# Altium schematic sheet SRAM & Expansion Port.SchDoc
size A
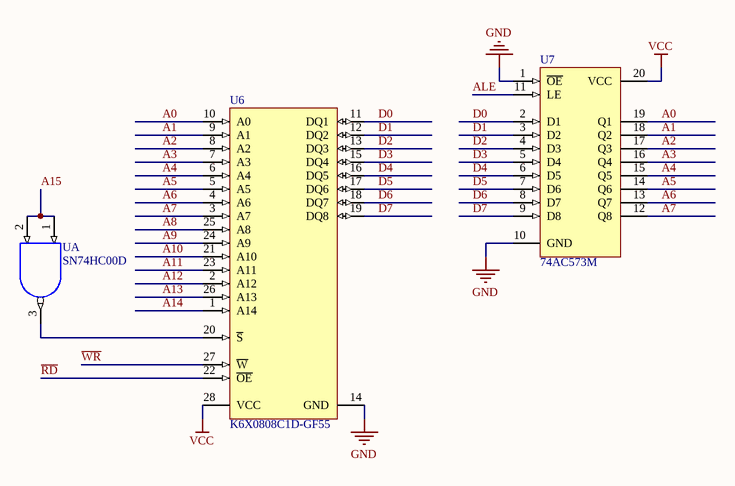
[diagram p0: SRAM & Expansion Port.SchDoc]

## Parts
U  SN74HC00D  [D014_N]  (part A of 4)
U6  K6X0808C1D-GF55  [PRSP0028DB-B_N]
U7  74AC573M  [SO20_N]

## Nets
GND: U.7(GND) U6.14(GND) U7.1(~{OE}) U7.10(GND)
VCC: U.14(VCC) U6.28(VCC) U7.20(VCC)
A0: U6.10(A0) U7.19(Q1)
A1: U6.9(A1) U7.18(Q2)
A2: U6.8(A2) U7.17(Q3)
A3: U6.7(A3) U7.16(Q4)
A4: U6.6(A4) U7.15(Q5)
A5: U6.5(A5) U7.14(Q6)
A6: U6.4(A6) U7.13(Q7)
A7: U6.3(A7) U7.12(Q8)
A8: U6.25(A8)
A9: U6.24(A9)
A10: U6.21(A10)
A11: U6.23(A11)
A12: U6.2(A12)
A13: U6.26(A13)
A14: U6.1(A14)
A15: U.1(A) U.2(B)
ALE: U7.11(LE)
D0: U6.11(DQ1) U7.2(D1)
D1: U6.12(DQ2) U7.3(D2)
D2: U6.13(DQ3) U7.4(D3)
D3: U6.15(DQ4) U7.5(D4)
D4: U6.16(DQ5) U7.6(D5)
D5: U6.17(DQ6) U7.7(D6)
D6: U6.18(DQ7) U7.8(D7)
D7: U6.19(DQ8) U7.9(D8)
~{RD}: U6.22(~{OE})
~{WR}: U6.27(~{W})
NetU_3: U.3(Y) U6.20(~{S})

## Library data of the parts
U = SN74HC00D: Quadruple 2-Input Positive-NAND Gate; Published: 8-Jun-2000; LatestRevisionDate: 13-Apr-2006; LatestRevisionNote: IPC-7351 Footprint Added.; DatasheetVersion: May-1997; PackageVersion: Jan-1998; PackageReference: D014; Publisher: Altium Limited; PackageDescription: 14-Pin Small Outline Integrated Circuit 1.27 mm Pitch; Code_IPC: SOIC127P600-14; ComponentLink1Description: Manufacturer Link; ComponentLink1URL: http://www.ti.com/; ComponentLink2Description: Datasheet; ComponentLink2URL: http://www-s.ti.com/sc/ds/sn74hc00.pdf
U6 = M5M5256DFP-55LL: 262144-bit (32768-word x 8-bit) CMOS SRAM; Published: 3-Mar-2010; DatasheetVersion: Rev.2.1, Feb-2004; PackageVersion: Sep-2005; PackageReference: PRSP0028DB-B; Publisher: Altium Limited; PackageDescription: 28-Pin Small Outline Integrated Circuit 1.27 mm Pitch; Code_JEITA: P-SOP28-8.4x17.5-1.27; ComponentLink1Description: Manufacturer Link; ComponentLink1URL: http://sg.renesas.com/products/memory/memory_category_landing.jsp; ComponentLink2Description: Datasheet; ComponentLink2URL: http://documentation.renesas.com/eng/products/memory/rej03c0055_m5m5256dfp.pdf; ComponentLink3Description: Packaging Specification; ComponentLink3URL: http://sg.renesas.com/media/products/common_info/package/pdf/ic/code/prsp0028db_b.pdf
U7 = 74AC573M: Octal D-Type Latch with 3-State Output Non-Inverting; Published: 8-Jun-2000; LatestRevisionDate: 13-Apr-2006; LatestRevisionNote: IPC-7351 Footprint Added.; DatasheetVersion: Apr-1997; PackageVersion: Jul-2001; PackageReference: SO20; Publisher: Altium Limited; PackageDescription: 20-Pin Plastic Small Outline Integrated Circuit 1.27 mm Pitch; Code_JEDEC: MS-013-AC; Code_IPC: SOIC127P1030-20; ComponentLink1Description: Manufacturer Link; ComponentLink1URL: http://www.st.com/; ComponentLink2Description: Datasheet; ComponentLink2URL: http://www.st.com/stonline/products/literature/ds/4702/74ac573.pdf